# EAGLE schematic msp432 feather board (EAGLE 9.5.2)
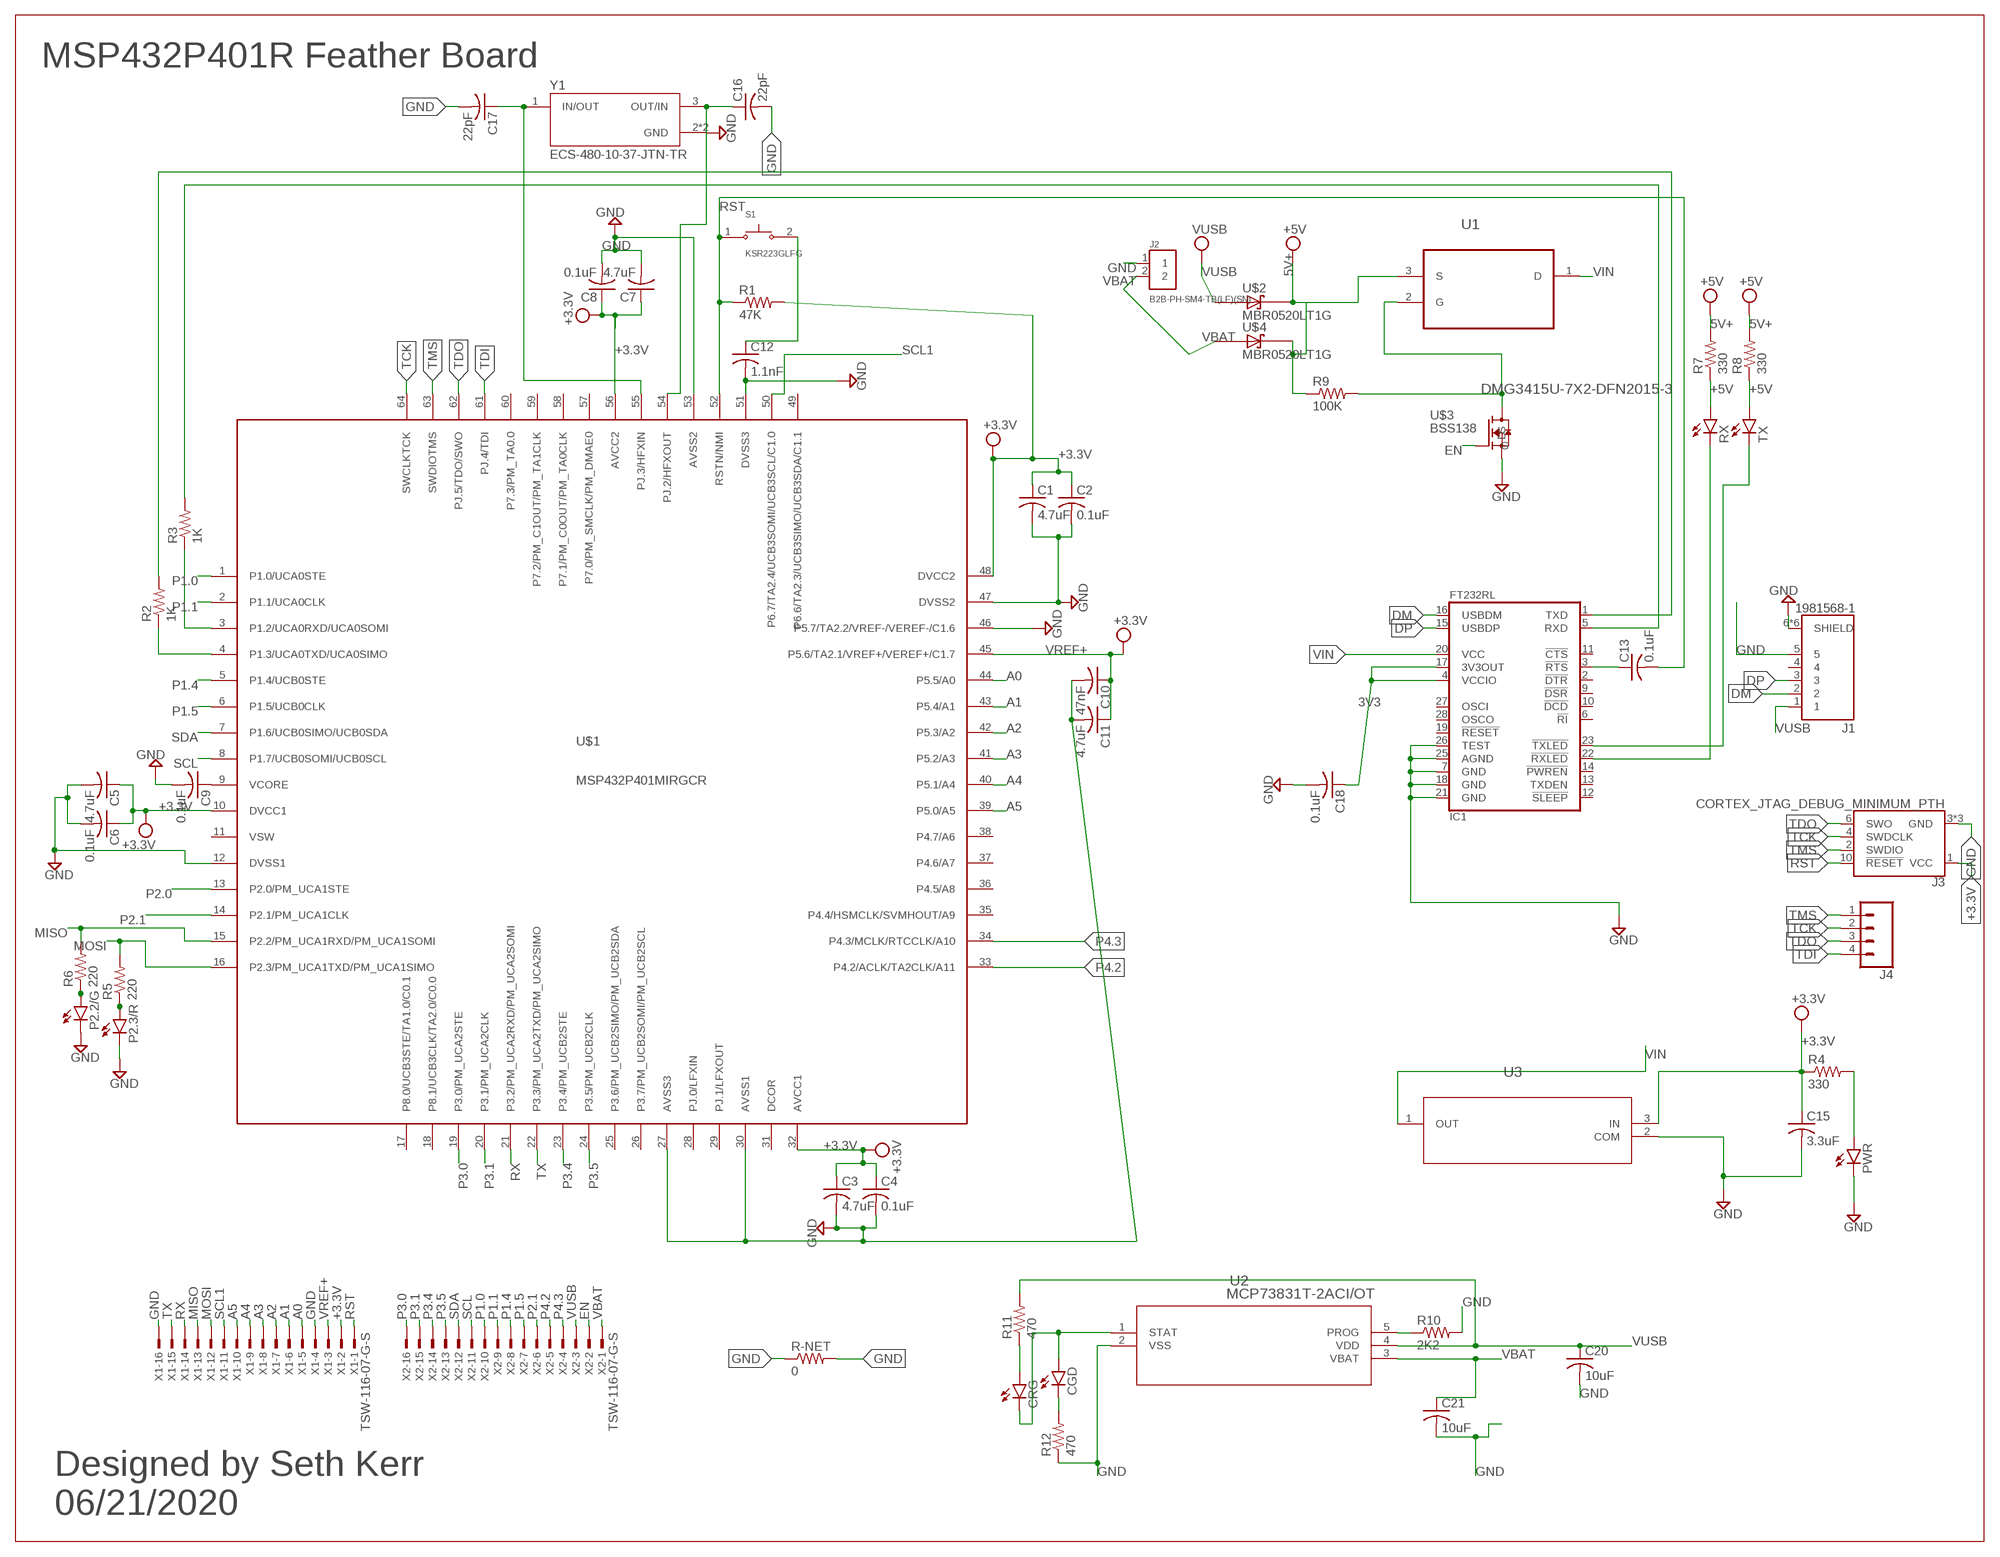
[diagram p0: schematic, sheet 1]

## Parts
C1  4.7uF  C-USC0603  [C0603]
C2  0.1uF  C-USC0402  [C0402]
C3  4.7uF  C-USC0603  [C0603]
C4  0.1uF  C-USC0402  [C0402]
C5  4.7uF  C-USC0603  [C0603]
C6  0.1uF  C-USC0402  [C0402]
C7  4.7uF  C-USC0603  [C0603]
C8  0.1uF  C-USC0402  [C0402]
C9  0.1uF  C-USC0402  [C0402]
C10  47nF  C-USC0402  [C0402]
C11  4.7uF  C-USC0603  [C0603]
C12  1.1nF  C-USC0402  [C0402]
C13  0.1uF  C-USC0603  [C0603]
C15  3.3uF  C-USC0603  [C0603]
C16  22pF  C-USC0402  [C0402]
C17  22pF  C-USC0402  [C0402]
C18  0.1uF  C-USC0402  [C0402]
C20  10uF  C-USC0603  [C0603]
C21  10uF  C-USC0603  [C0603]
CGD  LEDCHIP-LED0603  [CHIP-LED0603]
CRG  LEDCHIP-LED0603  [CHIP-LED0603]
IC1  FT232RL  [SSOP28-LD]
J1  1981568-1  [TE_1981568-1]
J2  B2B-PH-SM4-TB(LF)(SN)  [JST_B2B-PH-SM4-TB(LF)(SN)]
J3  CORTEX_JTAG_DEBUG_MINIMUM_PTH  [2X5-PTH-1.27MM]
J4  CONN_041X04_NO_SILK  [1X04_NO_SILK]
P2.2/G  LEDCHIP-LED0603  [CHIP-LED0603]
P2.3/R  LEDCHIP-LED0603  [CHIP-LED0603]
PWR  LEDCHIP-LED0603  [CHIP-LED0603]
R1  47K  R-US_R0402  [R0402]
R2  1K  R-US_R0402  [R0402]
R3  1K  R-US_R0402  [R0402]
R4  330  R-US_R0402  [R0402]
R5  220  R-US_R0402  [R0402]
R6  220  R-US_R0402  [R0402]
R7  330  R-US_R0402  [R0402]
R8  330  R-US_R0402  [R0402]
R9  100K  R-US_R0402  [R0402]
R10  2K2  R-US_R0402  [R0402]
R11  470  R-US_R0402  [R0402]
R12  470  R-US_R0402  [R0402]
R-NET  0  R-US_R0805  [R0805]
RX  LEDCHIP-LED0603  [CHIP-LED0603]
S1  KSR223GLFG  [SW_KSR223GLFG]
TX  LEDCHIP-LED0603  [CHIP-LED0603]
U1  DMG3415U-7X2-DFN2015-3  [X2-DFN2015-3]
U2  MCP73831T-2ACI/OT  [SOT-23-5_MC]
U3  UA78M05CDCYR  [DCY4]
U$1  MSP432P401MIRGCR  [MSP432_QFN_64]
U$2  MBR0520LT1G  [SOD3716X117(SOD-123)]
U$3  BSS138  [BSS138]
U$4  MBR0520LT1G  [SOD3716X117(SOD-123)]
X1  TSW-116-07-G-S  [TSW-116-XX-G-S]
X2  TSW-116-07-G-S  [TSW-116-XX-G-S]
Y1  ECS-480-10-37-JTN-TR  [XTAL_ECS-480-10-37-JTN-TR]

## Nets
3V3 [PWR]: C18.1 IC1.4(VCCIO) IC1.17(3V3OUT)
5V+ [PWR]: R7.2 R8.2 R9.1 U1.3(S) U$2.1(C) U$4.1(C) ; supply symbol labelled +5V
+3.3V [PWR]: C1.1 C2.1 C3.1 C4.1 C5.1 C6.1 C7.1 C8.1 C15.1 J3.1(VCC) R1.2 R4.1 U3.3(IN) U$1.10(DVCC1) U$1.32(AVCC1) U$1.48(DVCC2) U$1.56(AVCC2) X1.2
+5V [PWR]: R7.1 R8.1 RX.A TX.A
A0 [analog]: U$1.44(P5.5/A0) X1.5
A1 [analog]: U$1.43(P5.4/A1) X1.6
A2 [analog]: U$1.42(P5.3/A2) X1.7
A3 [analog]: U$1.41(P5.2/A3) X1.8
A4 [analog]: U$1.40(P5.1/A4) X1.9
A5 [analog]: U$1.39(P5.0/A5) X1.10
DM: IC1.16(USBDM) J1.2
DP: IC1.15(USBDP) J1.3
EN: U$3.G X2.2
GND [PWR]: C1.2 C2.2 C3.2 C4.2 C5.2 C6.2 C7.2 C8.2 C9.2 C10.2 C11.2 C12.2 C15.2 C16.2 C17.2 C18.2 C20.2 C21.2 IC1.7(GND) IC1.18(GND) IC1.21(GND) IC1.25(AGND) IC1.26(TEST) J1.5 J1.6(SHIELD) J1.7(SHIELD) J1.8(SHIELD) J1.9(SHIELD) J1.10(SHIELD) J1.11(SHIELD) J2.1 J3.3(GND) J3.5(GND) J3.9(GND) P2.2/G.C P2.3/R.C PWR.C R10.2 R12.1 R-NET.1 R-NET.2 U2.2(VSS) U3.2(COM) U$1.12(DVSS1) U$1.27(AVSS3) U$1.30(AVSS1) U$1.46(P5.7/TA2.2/VREF-/VEREF-/C1.6) U$1.47(DVSS2) U$1.51(DVSS3) U$1.53(AVSS2) U$3.S X1.4 X1.16 Y1.2(GND) Y1.4(GND)
MISO [digital]: R6.2 U$1.15(P2.2/PM_UCA1RXD/PM_UCA1SOMI) X1.13
MOSI [digital]: R5.2 U$1.16(P2.3/PM_UCA1TXD/PM_UCA1SIMO) X1.12
N$1: C9.1 U$1.9(VCORE)
N$2: R10.1 U2.5(PROG)
N$3: C13.1 IC1.3(!RTS)
N$7: IC1.5(RXD) R3.2
N$8: IC1.1(TXD) R2.2
N$10: C12.1 S1.2
N$11: IC1.22(!RXLED) RX.C
N$12: IC1.23(!TXLED) TX.C
N$13: P2.2/G.A R6.1
N$14: R2.1 U$1.4(P1.3/UCA0TXD/UCA0SIMO)
N$15: R3.1 U$1.3(P1.2/UCA0RXD/UCA0SOMI)
N$17: R9.2 U1.2(G) U$3.D
N$18: CGD.A CRG.C U2.1(STAT)
N$24: CGD.C R12.2
N$25: CRG.A R11.1
N$41: PWR.A R4.2
N$42: P2.3/R.A R5.1
N$47: C16.1 U$1.54(PJ.2/HFXOUT) Y1.3(OUT/IN)
N$48: C17.1 U$1.55(PJ.3/HFXIN) Y1.1(IN/OUT)
P1.0 [digital]: U$1.1(P1.0/UCA0STE) X2.10
P1.1 [digital]: U$1.2(P1.1/UCA0CLK) X2.9
P1.4 [digital]: U$1.5(P1.4/UCB0STE) X2.8
P1.5 [digital]: U$1.6(P1.5/UCB0CLK) X2.7
P2.0: U$1.13(P2.0/PM_UCA1STE)
P2.1 [digital]: U$1.14(P2.1/PM_UCA1CLK) X2.6
P3.0: U$1.19(P3.0/PM_UCA2STE) X2.16
P3.1: U$1.20(P3.1/PM_UCA2CLK) X2.15
P3.4 [digital]: U$1.23(P3.4/PM_UCB2STE) X2.14
P3.5 [digital]: U$1.24(P3.5/PM_UCB2CLK) X2.13
P4.2: U$1.33(P4.2/ACLK/TA2CLK/A11) X2.5
P4.3: U$1.34(P4.3/MCLK/RTCCLK/A10) X2.4
RST: C13.2 J3.10(!RESET) R1.1 S1.1 U$1.52(RSTN/NMI) X1.1
RX [digital]: U$1.21(P3.2/PM_UCA2RXD/PM_UCA2SOMI) X1.14
SCL [analog]: U$1.8(P1.7/UCB0SOMI/UCB0SCL) X2.11
SCL1 [analog]: U$1.50(P6.7/TA2.4/UCB3SOMI/UCB3SCL/C1.0) X1.11
SDA [analog]: U$1.7(P1.6/UCB0SIMO/UCB0SDA) X2.12
TCK: J3.4(SWDCLK) J4.2 U$1.64(SWCLKTCK)
TDI: J4.4 U$1.61(PJ.4/TDI)
TDO: J3.6(SWO) J4.3 U$1.62(PJ.5/TDO/SWO)
TMS: J3.2(SWDIO) J4.1 U$1.63(SWDIOTMS)
TX [digital]: U$1.22(P3.3/PM_UCA2TXD/PM_UCA2SIMO) X1.15
VBAT [PWR]: C21.1 J2.2 U2.3(VBAT) U$4.2(A) X2.1
VIN [PWR]: IC1.20(VCC) U1.1(D) U3.1(OUT)
VREF+ [analog]: C10.1 C11.1 U$1.45(P5.6/TA2.1/VREF+/VEREF+/C1.7) X1.3 ; supply symbol labelled +3.3V
VUSB [PWR]: C20.1 J1.1 R11.2 U2.4(VDD) U$2.2(A) X2.3
Unconnected: IC1.2(!DTR) IC1.6(!RI) IC1.9(!DSR) IC1.10(!DCD) IC1.11(!CTS) IC1.12(!SLEEP) IC1.13(TXDEN) IC1.14(!PWREN) IC1.19(!RESET) IC1.27(OSCI) IC1.28(OSCO) J1.4 U$1.11(VSW) U$1.17(P8.0/UCB3STE/TA1.0/C0.1) U$1.18(P8.1/UCB3CLK/TA2.0/C0.0) U$1.25(P3.6/PM_UCB2SIMO/PM_UCB2SDA) U$1.26(P3.7/PM_UCB2SOMI/PM_UCB2SCL) U$1.28(PJ.0/LFXIN) U$1.29(PJ.1/LFXOUT) U$1.31(DCOR) U$1.35(P4.4/HSMCLK/SVMHOUT/A9) U$1.36(P4.5/A8) U$1.37(P4.6/A7) U$1.38(P4.7/A6) U$1.49(P6.6/TA2.3/UCB3SIMO/UCB3SDA/C1.1) U$1.57(P7.0/PM_SMCLK/PM_DMAE0) U$1.58(P7.1/PM_C0OUT/PM_TA0CLK) U$1.59(P7.2/PM_C1OUT/PM_TA1CLK) U$1.60(P7.3/PM_TA0.0)

## Notes on the sheet
- MSP432P401R Feather Board
- Designed by Seth Kerr
  06/21/2020

## Library data of the parts
C1-C13 C15-C18 C20 C21 = rcl:C-US: CAPACITOR, American symbol; SPICEPREFIX: C
CGD CRG P2.2/G P2.3/R PWR RX TX = led:LED: LED OSRAM: - CHIPLED LG R971, LG N971, LY N971, LG Q971, LY Q971, LO R971, LY R971 LH N974, LH R974 LS Q976, LO Q976, LY Q976 LO Q996 - Hyper CHIPLED LW Q18S LB Q993, LB Q99A, LB R99A - SideLED LS A670, LO A670, LY A670, LG A670, LP A670 LB A673, LV A673, LT A673, LW A673 LH A674 LY A675 LS A676, LA A676, LO A676, LY A676, LW A676 LS A679, LY A679, LG A679 - Hyper Micro SIDELED® LS Y876, LA Y876, LO Y876, LY Y876 LT Y87S - SmartLED LW L88C, LW L88S LB L89C, LB L89S, LG L890 LS L89K, LO L89K, LY L89K LS L896, LA L896, LO L896, LY L896 - TOPLED LS T670, LO T670, LY T670, LG T670, LP T670 LSG T670, LSP T670, LSY T670, LOP T670, LYG T670 LG T671, LOG T671, LSG T671 LB T673, LV T673, LT T673, LW T673 LH T674 LS T676, LA T676, LO T676, LY T676, LB T676, LH T676, LSB T676, LW T676 LB T67C, LV T67C, LT T67C, LS T67K, LO T67K, LY T67K, LW E67C LS E67B, LA E67B, LO E67B, LY E67B, LB E67C, LV E67C, LT E67C LW T67C LS T679, LY T679, LG T679 LS T770, LO T770, LY T770, LG T770, LP T770 LB T773, LV T773, LT T773, LW T773 LH T774 LS E675, LA E675, LY E675, LS T675 LS T776, LA T776, LO T776, LY T776, LB T776 LHGB T686 LT T68C, LB T68C - Hyper Mini TOPLED® LB M676 - Mini TOPLED Santana® LG M470 LS M47K, LO M47K, LY M47K Source: http://www.osram.convergy.de LUXEON: - LUMILED® LXK2-PW12-R00, LXK2-PW12-S00, LXK2-PW14-U00, LXK2-PW14-V00 LXK2-PM12-R00, LXK2-PM12-S00, LXK2-PM14-U00 LXK2-PE12-Q00, LXK2-PE12-R00, LXK2-PE12-S00, LXK2-PE14-T00, LXK2-PE14-U00 LXK2-PB12-K00, LXK2-PB12-L00, LXK2-PB12-M00, LXK2-PB14-N00, LXK2-PB14-P00, LXK2-PB14-Q00 LXK2-PR12-L00, LXK2-PR12-M00, LXK2-PR14-Q00, LXK2-PR14-R00 LXK2-PD12-Q00, LXK2-PD12-R00, LXK2-PD12-S00 LXK2-PH12-R00, LXK2-PH12-S00 LXK2-PL12-P00, LXK2-PL12-Q00, LXK2-PL12-R00 Source: www.luxeon.com KINGBRIGHT: KA-3528ASYC Source: www.kingbright.com
IC1 = FT232RL:FT232RL; AVAILABILITY: Unavailable; DESCRIPTION: USB Bridge, USB to UART USB 2.0 UART Interface 28-SSOP; MF: FTDI, Future; MP: FT232RL; PACKAGE: SSOP-28 FTDI, Future; PRICE: None
J1 = 1981568-1:1981568-1: CONN RCPT MICRO USB B R/A SMD; AVAILABILITY: Unavailable; DESCRIPTION: USB - micro B USB 2.0 Receptacle Connector 5 Position Surface Mount, Right Angle; MF: TE Connectivity; MP: 19815681; PACKAGE: None; PRICE: None; TE_PURCHASE_URL: https://www.te.com/usa-en/product-19815681.html?te_bu=Cor&te_type=disp&te_campaign=seda_glo_cor-seda-global-disp-prtnr-fy19-seda-model-bom-cta_sma-317_1&elqCampaignId=32493
J2 = B2B-PH-SM4-TB_LF__SN_:B2B-PH-SM4-TB(LF)(SN): PH Series 2 Position 2 mm Pitch Surface Mount Top Entry Shrouded Header; AVAILABILITY: Unavailable; DESCRIPTION: Connector Header Surface Mount 2 position 0.079 _2.00mm_; MF: JST Sales; MP: B2B-PH-SM4-TB_LF__SN_; PACKAGE: None; PRICE: None
J3 = SparkFun-Connectors:CORTEX_JTAG_DEBUG_MINIMUM: Cortex Debug Connector - 10 pin Supports JTAG debug, Serial Wire debug, and Serial Wire Viewer. PTH and SMD connector options available. General Connector Information <http://infocenter.arm.com/help/topic/com.arm.doc.faqs/attached/13634/cortex_debug_connectors.pdf> Products: PTH Connector <http://www.digikey.com/product-detail/en/cnc-tech/3220-10-0100-00/1175-1627-ND/3883661> -via Digi-Key SparkFun PSoc <https://www.sparkfun.com/products/13229> SparkFun T <https://www.sparkfun.com/products/13810>
J4 = SparkFun-Connectors:CONN_04: Multi connection point. Often used as Generic Header-pin footprint for 0.1 inch spaced/style header connections On any of the 0.1 inch spaced packages, you can populate with these: Break Away Headers - Straight <https://www.sparkfun.com/products/116> (PRT-00116) Break Away Male Headers - Right Angle <https://www.sparkfun.com/products/553> (PRT-00553) Female Headers <https://www.sparkfun.com/products/115> (PRT-00115) Break Away Headers - Machine Pin <https://www.sparkfun.com/products/117> (PRT-00117) Break Away Female Headers - Swiss Machine Pin <https://www.sparkfun.com/products/743> (PRT-00743) For SCREWTERMINALS and SPRING TERMINALS visit here: Screw Terimnals on SparkFun.com <https://www.sparkfun.com/search/results?term=Screw+Terminals> (5mm/3.5mm/2.54mm spacing) This device is also useful as a general connection point to wire up your design to another part of your project. Our various solder wires solder well into these plated through hole pads. Hook-Up Wire - Assortment (Stranded, 22 AWG) <https://www.sparkfun.com/products/11375> (PRT-11375) Hook-Up Wire - Assortment (Solid Core, 22 AWG) <https://www.sparkfun.com/products/11367> (PRT-11367) View the entire wire category on our website here <https://www.sparkfun.com/categories/141> Special notes: Molex polarized connector foot print use with SKU : PRT-08231 with associated crimp pins and housings. 1MM SMD Version SKU: PRT-10208; PROD_ID: CONN-09696
R1-R12 R-NET = rcl:R-US_: RESISTOR, American symbol; SPICEPREFIX: R
S1 = KSR223GLFG:KSR223GLFG: Switch Tactile N.O. SPST Round Button Gull Wing 0.01A 32VDC 0.2VA 200000Cycles 2N SMD Automotive T/R; AVAILABILITY: Unavailable; DESCRIPTION: Tactile Switch SPST-NO Top Actuated Surface Mount; MF: C&K; MP: KSR223GLFG; PACKAGE: None; PRICE: None
U1 = DMG3415U-7:DMG3415U-7: P-CHANNEL ENHANCEMENT MODE MOSFET
U2 = MCP73831-2ACI:MCP73831T-2ACI/OT; BUILT_BY: EMA_UL_Team; MANUFACTURER_PART_NUMBER: MCP73831T-2ACI/OT; VENDOR: Microchip
U3 = UA78M05CDCYR:UA78M05CDCYR; BUILT_BY: EMA_UL_Team; MANUFACTURER_PART_NUMBER: UA78M05CDCYR; VENDOR: Texas Instruments
U$1 = MSP432P401MIRGCR:MSP432P401MIRGCR; AVAILABILITY: Unavailable; DESCRIPTION: ARM® Cortex®-M4F MSP432™ Microcontroller IC 32-Bit 48MHz 128KB _128K x 8_ FLASH 64-VQFN _9x9_; MF: Texas Instruments; MP: MSP432P401MIRGCR; PACKAGE: VQFN-64 Texas Instruments; PRICE: None
U$2 U$4 = MBR0520LT1G:MBR0520LT1G: Surface Mount Schottky Power Rectifier Plastic SOD−123 Package; AVAILABILITY: Unavailable; DESCRIPTION: Diode Schottky 20V 500mA Surface Mount SOD-123; MF: ON Semiconductor; MP: MBR0520LT1G; PACKAGE: SOD-123 ON Semiconductor; PRICE: None
U$3 = BSS138:BSS138: BSS138 N-Channel Logic Level Enhancement Mode Field Effect Transistor; AVAILABILITY: Unavailable; DESCRIPTION: N-Channel 50V 220mA _Ta_ 360mW _Ta_ Surface Mount Die; MF: MICROSS/On Semiconductor; MP: BSS138; PACKAGE: TO-236-3 Micross; PRICE: None
X1 X2 = con-samtec:TSW-116-*-G-S: THROUGH-HOLE .025" SQ POST HEADER Source: Samtec TSW.pdf; MF: Samtec Inc.; MPN: TSW-116-07-G-S
Y1 = ECS-480-10-37-JTN-TR:ECS-480-10-37-JTN-TR: SMD Crystal 2.0 x 1.6 x 0.45 mm ceramic package; AVAILABILITY: Unavailable; DESCRIPTION: 48MHz ±20ppm Crystal 10pF 50 Ohms 4-SMD, No Lead; MF: ECS Inc.; MP: ECS-480-10-37-JTN-TR; PACKAGE: SMD-4 ECS International; PRICE: None

## Net classes
0 default: width 0.203 mm, clearance 0.127 mm
1 PWR: width 0.203 mm, clearance 0.127 mm
2 analog: width 0.152 mm, clearance 0.152 mm
3 digital: width 0.203 mm, clearance 0.152 mm